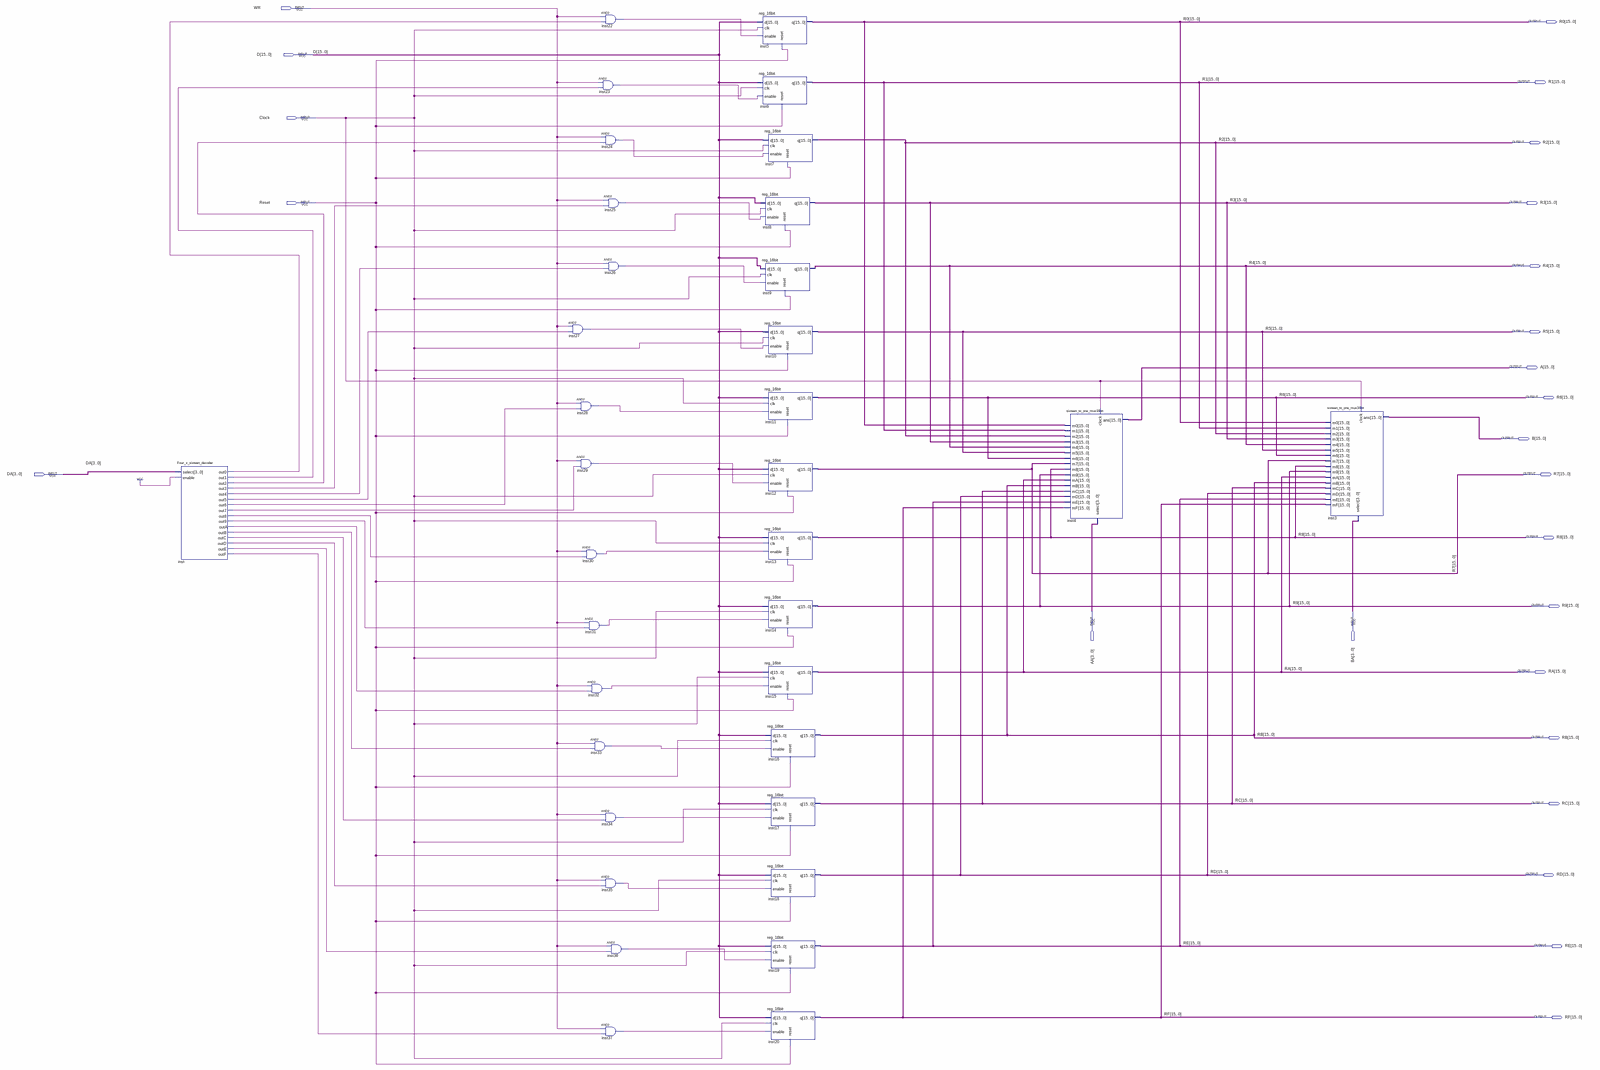
[diagram p0: schematic sheet, whole]
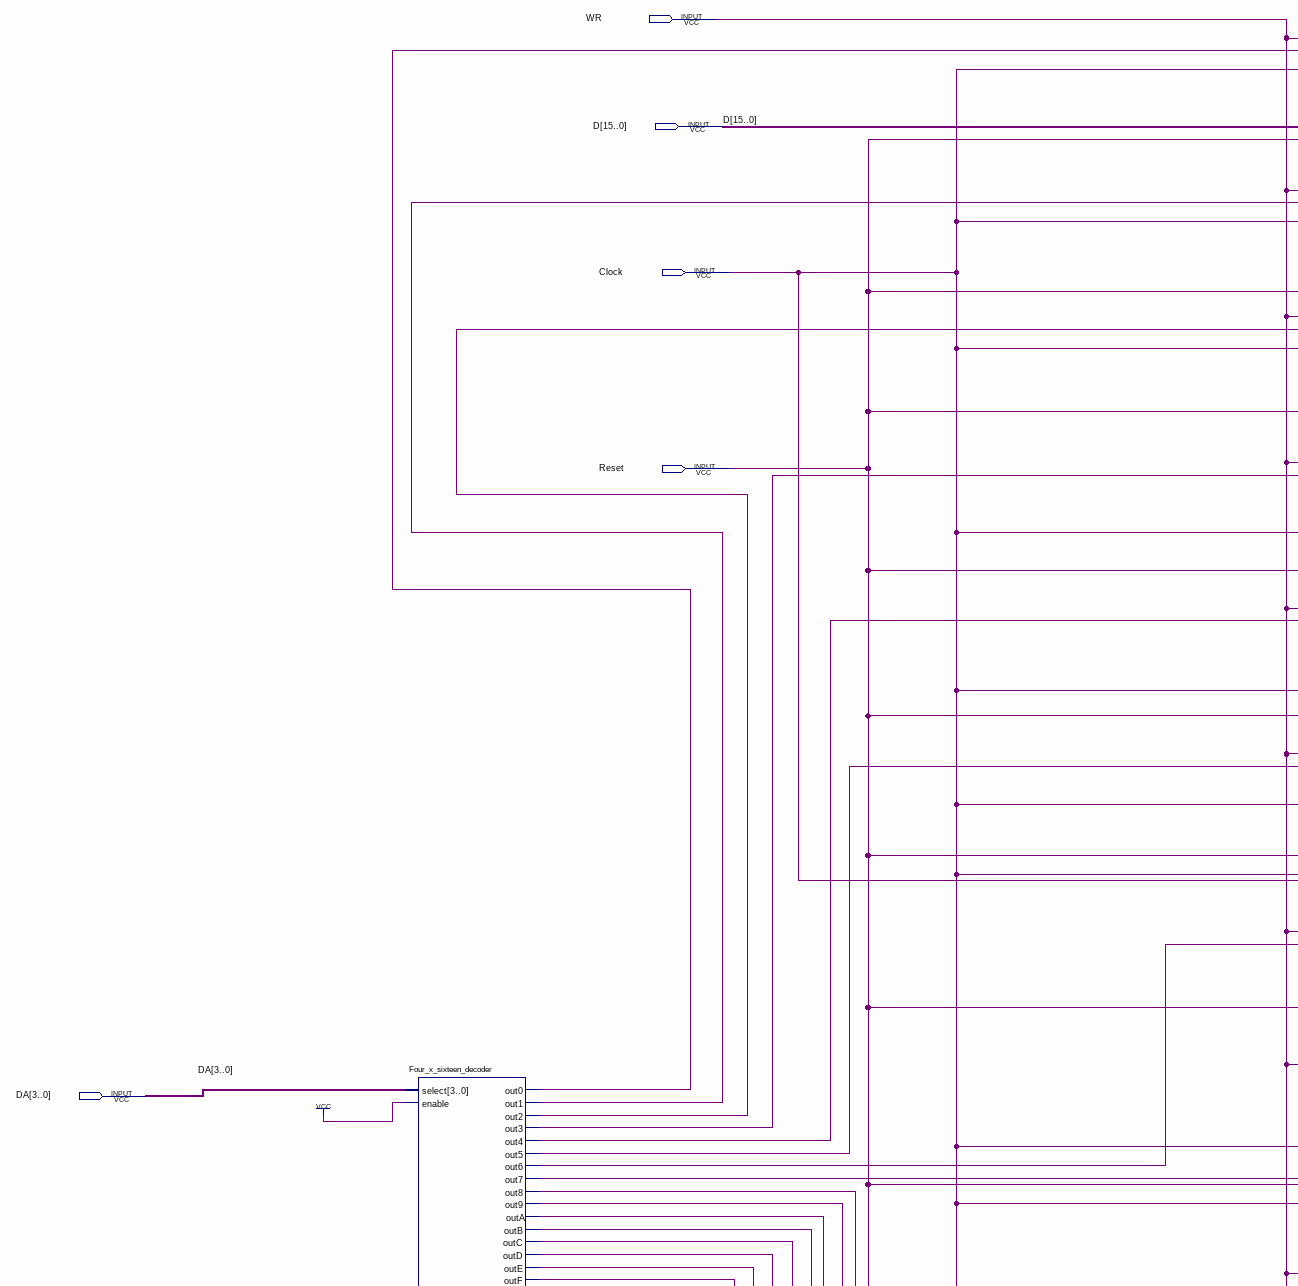
[diagram p1: schematic sheet, upper left part]
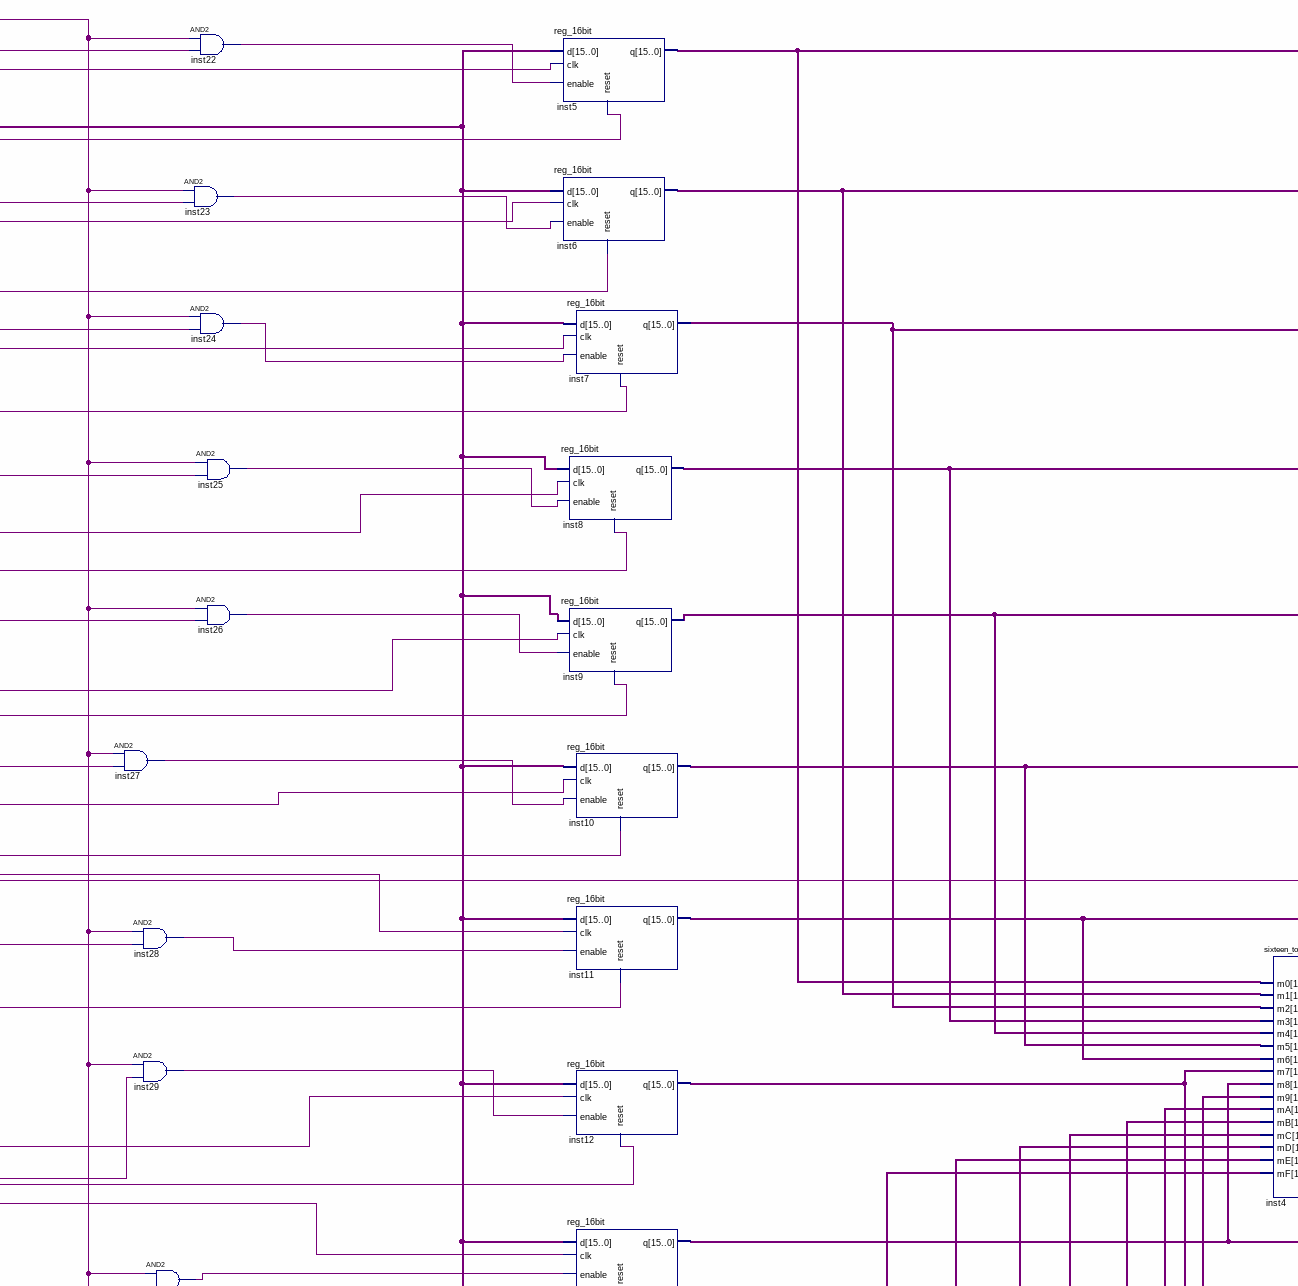
[diagram p2: schematic sheet, upper centre part]
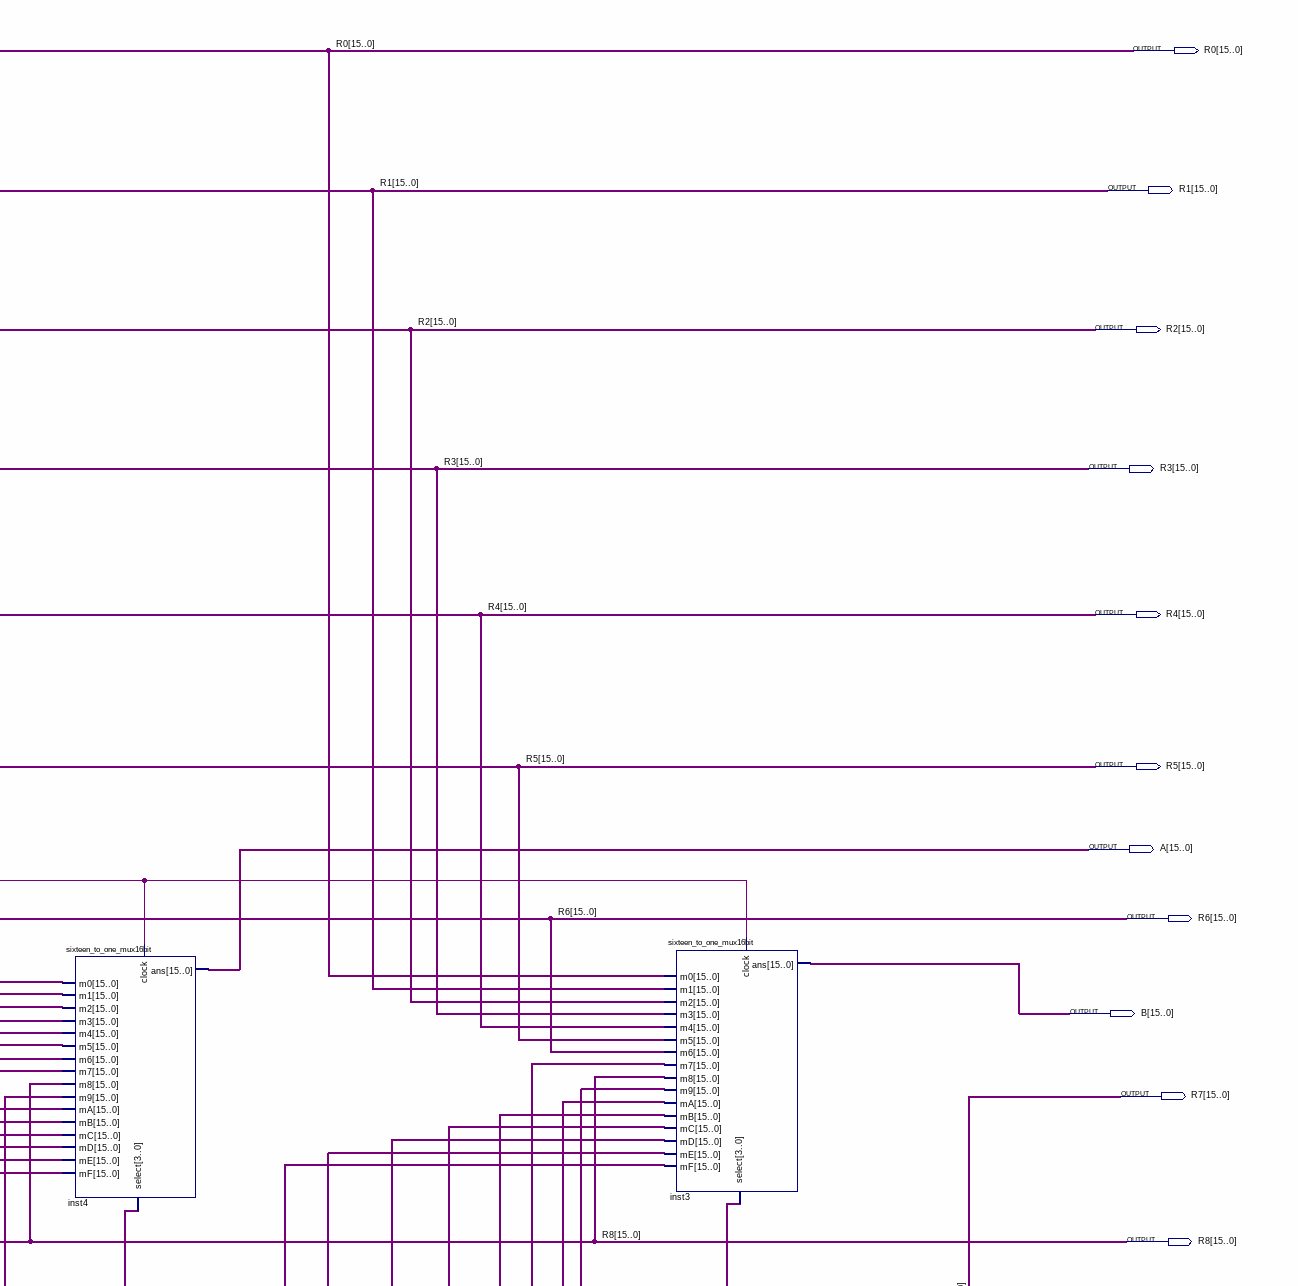
[diagram p3: schematic sheet, upper right part]
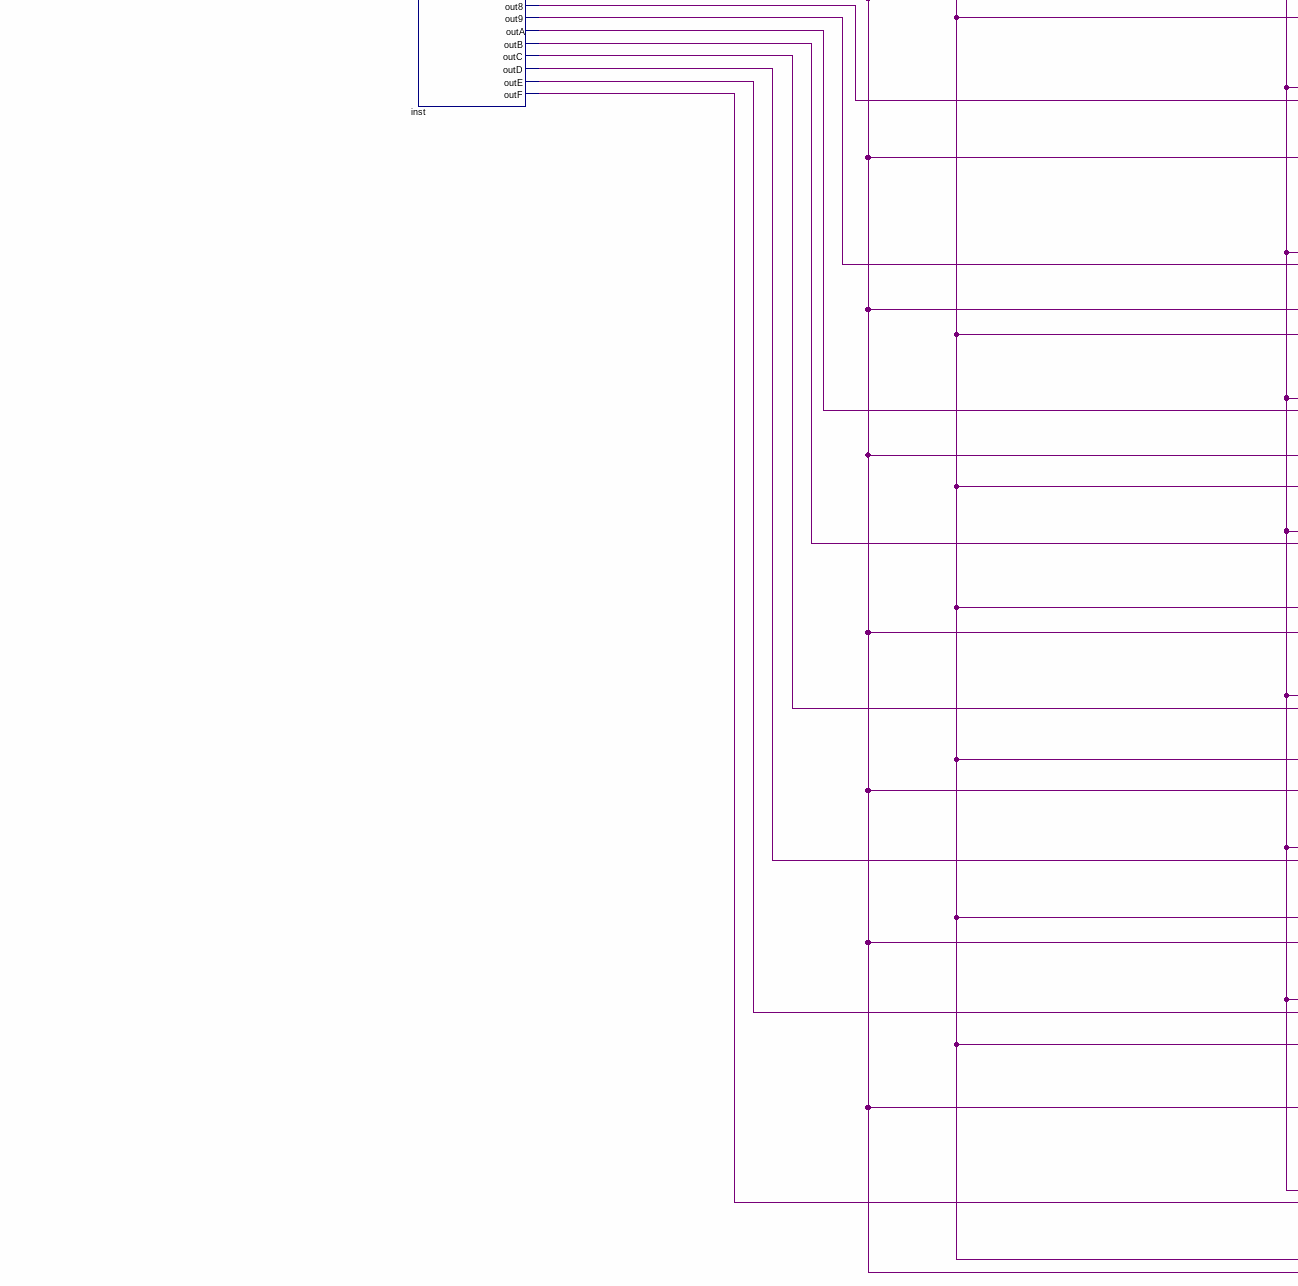
[diagram p4: schematic sheet, lower left part]
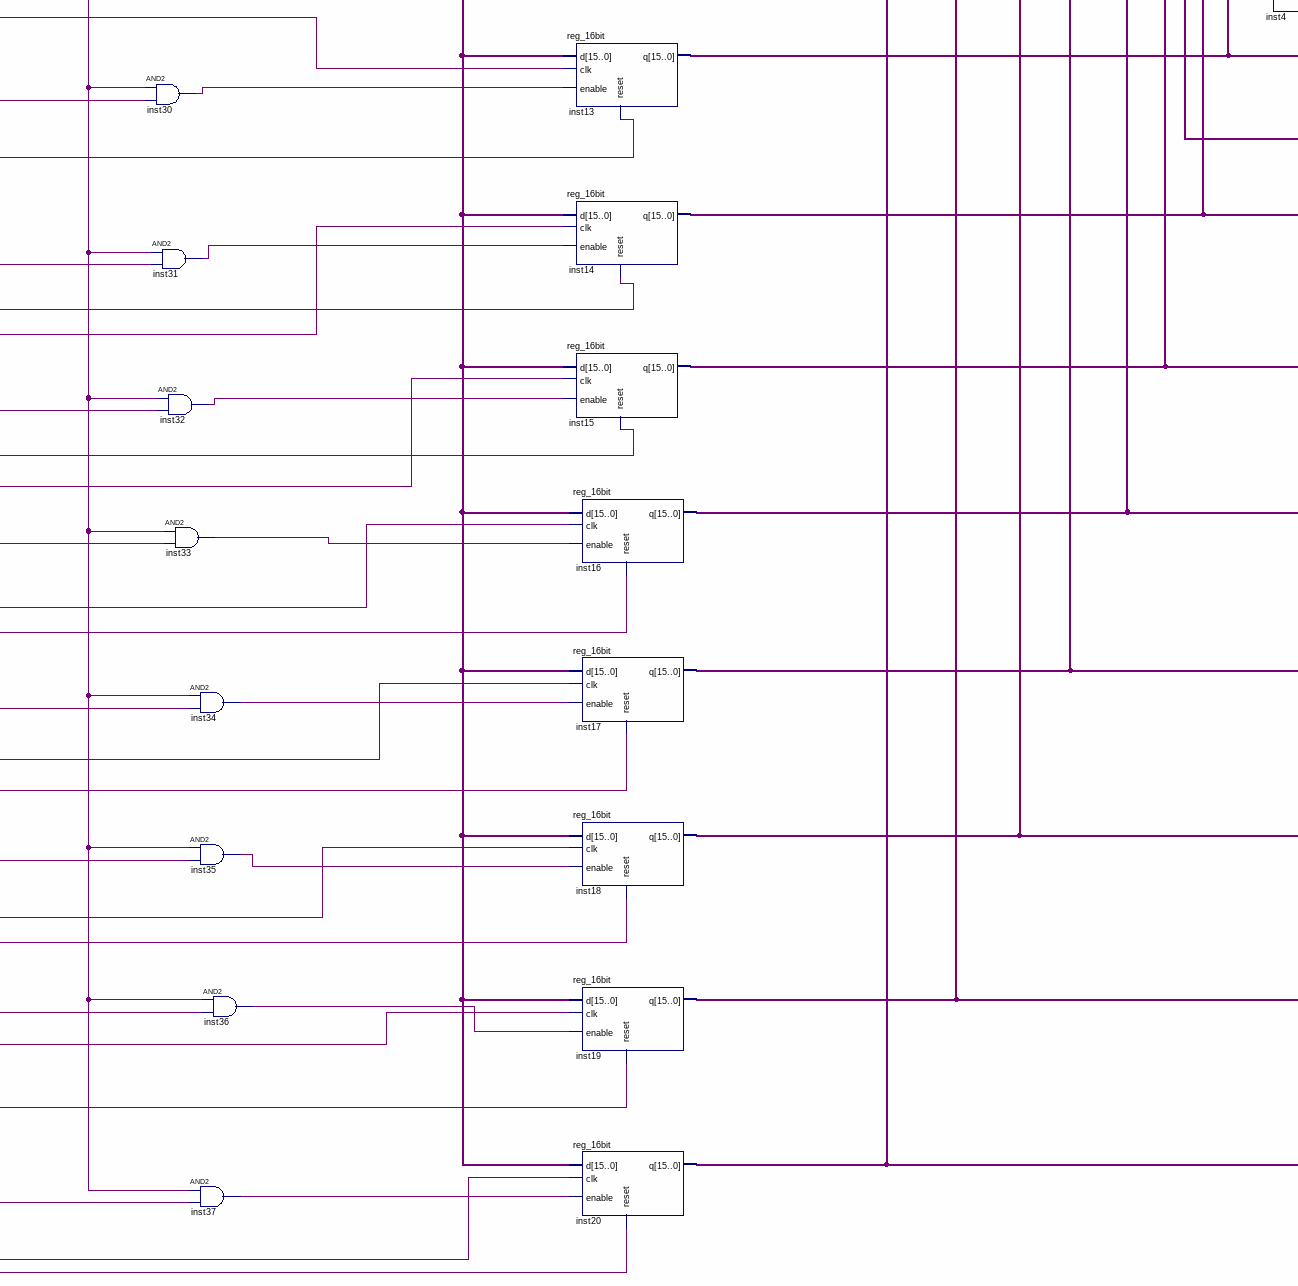
[diagram p5: schematic sheet, lower centre part]
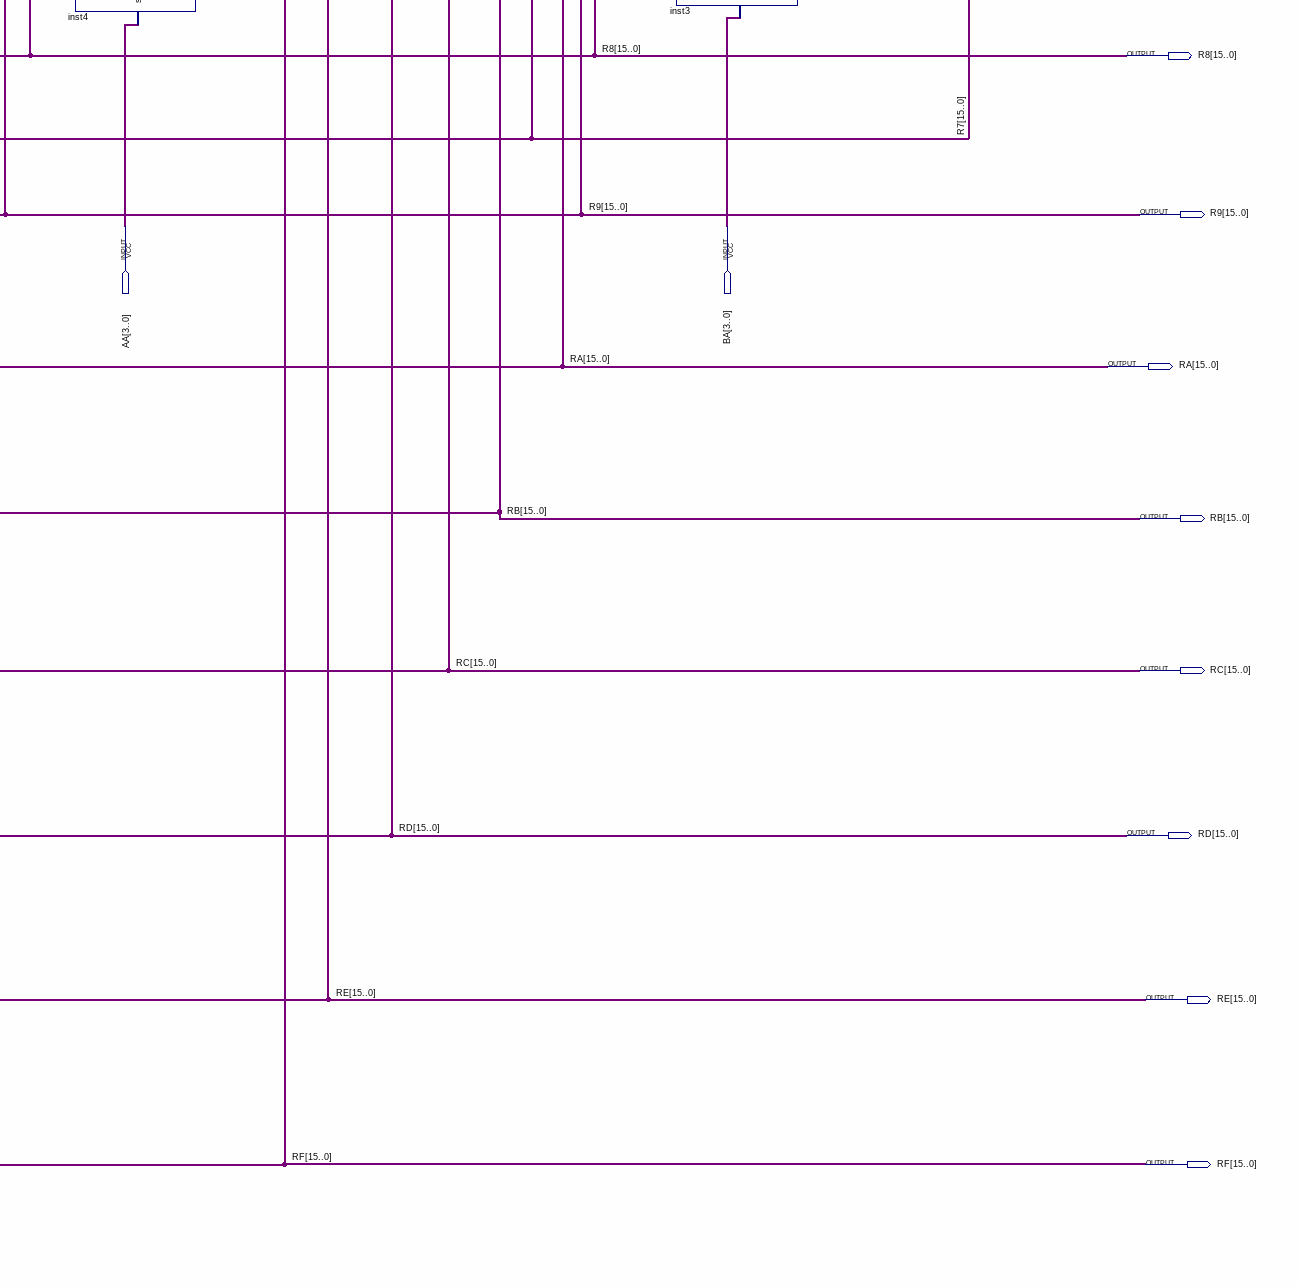
[diagram p6: schematic sheet, lower right part]
// Quartus schematic register_file.bdf as structural Verilog: 35 symbols, 25 pins
module register_file (
  input  WR,
  input  [15:0] D,
  input  Clock,
  input  Reset,
  input  [3:0] DA,
  input  [3:0] AA,
  input  [3:0] BA,
  output [15:0] R0,
  output [15:0] R1,
  output [15:0] R2,
  output [15:0] R3,
  output [15:0] R4,
  output [15:0] R5,
  output [15:0] A,
  output [15:0] R6,
  output [15:0] B,
  output [15:0] R7,
  output [15:0] R8,
  output [15:0] R9,
  output [15:0] RA,
  output [15:0] RB,
  output [15:0] RC,
  output [15:0] RD,
  output [15:0] RE,
  output [15:0] RF
);

  wire inst22_out, inst23_out, inst24_out, inst25_out, inst26_out, inst27_out, inst28_out, inst29_out,
       inst30_out, inst31_out, inst32_out, inst33_out, inst34_out, inst35_out, inst36_out, inst37_out,
       inst_out0, inst_out1, inst_out2, inst_out3, inst_out4, inst_out5, inst_out6, inst_out7, inst_out8,
       inst_out9, inst_outa, inst_outb, inst_outc, inst_outd, inst_oute, inst_outf;

  Four_x_sixteen_decoder inst (
    .select(DA), .enable(1'b1), .out0(inst_out0), .out1(inst_out1), .out2(inst_out2), .out3(inst_out3),
    .out4(inst_out4), .out5(inst_out5), .out6(inst_out6), .out7(inst_out7), .out8(inst_out8),
    .out9(inst_out9), .outA(inst_outa), .outB(inst_outb), .outC(inst_outc), .outD(inst_outd),
    .outE(inst_oute), .outF(inst_outf));
  and inst27 (inst27_out, WR, inst_out5);
  and inst28 (inst28_out, WR, inst_out6);
  and inst29 (inst29_out, WR, inst_out7);
  and inst30 (inst30_out, WR, inst_out8);
  and inst31 (inst31_out, WR, inst_out9);
  and inst32 (inst32_out, WR, inst_outa);
  and inst22 (inst22_out, WR, inst_out0);
  and inst23 (inst23_out, WR, inst_out1);
  and inst24 (inst24_out, WR, inst_out2);
  and inst25 (inst25_out, WR, inst_out3);
  and inst26 (inst26_out, WR, inst_out4);
  and inst33 (inst33_out, WR, inst_outb);
  and inst34 (inst34_out, WR, inst_outc);
  and inst35 (inst35_out, WR, inst_outd);
  and inst36 (inst36_out, WR, inst_oute);
  and inst37 (inst37_out, WR, inst_outf);
  reg_16bit inst5 (.clk(Clock), .enable(inst22_out), .d(D), .reset(Reset), .q(R0));
  reg_16bit inst6 (.clk(Clock), .enable(inst23_out), .d(D), .reset(Reset), .q(R1));
  reg_16bit inst7 (.clk(Clock), .enable(inst24_out), .d(D), .reset(Reset), .q(R2));
  reg_16bit inst8 (.clk(Clock), .enable(inst25_out), .d(D), .reset(Reset), .q(R3));
  reg_16bit inst9 (.clk(Clock), .enable(inst26_out), .d(D), .reset(Reset), .q(R4));
  reg_16bit inst10 (.clk(Clock), .enable(inst27_out), .d(D), .reset(Reset), .q(R5));
  reg_16bit inst11 (.clk(Clock), .enable(inst28_out), .d(D), .reset(Reset), .q(R6));
  reg_16bit inst12 (.clk(Clock), .enable(inst29_out), .d(D), .reset(Reset), .q(R7));
  reg_16bit inst13 (.clk(Clock), .enable(inst30_out), .d(D), .reset(Reset), .q(R8));
  reg_16bit inst14 (.clk(Clock), .enable(inst31_out), .d(D), .reset(Reset), .q(R9));
  reg_16bit inst15 (.clk(Clock), .enable(inst32_out), .d(D), .reset(Reset), .q(RA));
  reg_16bit inst16 (.clk(Clock), .enable(inst33_out), .d(D), .reset(Reset), .q(RB));
  reg_16bit inst17 (.clk(Clock), .enable(inst34_out), .d(D), .reset(Reset), .q(RC));
  reg_16bit inst18 (.clk(Clock), .enable(inst35_out), .d(D), .reset(Reset), .q(RD));
  reg_16bit inst19 (.clk(Clock), .enable(inst36_out), .d(D), .reset(Reset), .q(RE));
  reg_16bit inst20 (.clk(Clock), .enable(inst37_out), .d(D), .reset(Reset), .q(RF));
  sixteen_to_one_mux16bit inst4 (
    .select(AA), .m0(R0), .m1(R1), .m2(R2), .m3(R3), .m4(R4), .m5(R5), .m6(R6), .m7(R7), .m8(R8), .m9(R9),
    .mA(RA), .mB(RB), .mC(RC), .mD(RD), .mE(RE), .mF(RF), .clock(Clock), .ans(A));
  sixteen_to_one_mux16bit inst3 (
    .select(BA), .m0(R0), .m1(R1), .m2(R2), .m3(R3), .m4(R4), .m5(R5), .m6(R6), .m7(R7), .m8(R8), .m9(R9),
    .mA(RA), .mB(RB), .mC(RC), .mD(RD), .mE(RE), .mF(RF), .clock(Clock), .ans(B));
endmodule
